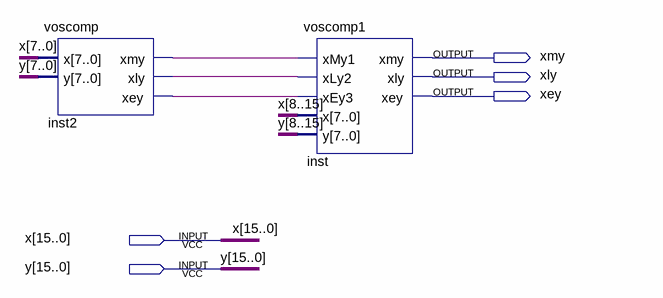
[diagram p0: schematic sheet]
// Quartus schematic hsestcomp.bdf as structural Verilog: 2 symbols, 5 pins
module hsestcomp (
  input  [15:0] x,
  input  [15:0] y,
  output xmy,
  output xly,
  output xey
);

  wire inst2_xey, inst2_xly, inst2_xmy;

  voscomp inst2 (.x(x[7:0]), .y(y[7:0]), .xmy(inst2_xmy), .xly(inst2_xly), .xey(inst2_xey));
  voscomp1 inst (
    .xMy1(inst2_xmy), .xLy2(inst2_xly), .xEy3(inst2_xey),
    .x({x[8], x[9], x[10], x[11], x[12], x[13], x[14], x[15]}),
    .y({y[8], y[9], y[10], y[11], y[12], y[13], y[14], y[15]}), .xmy(xmy), .xly(xly), .xey(xey));
endmodule
